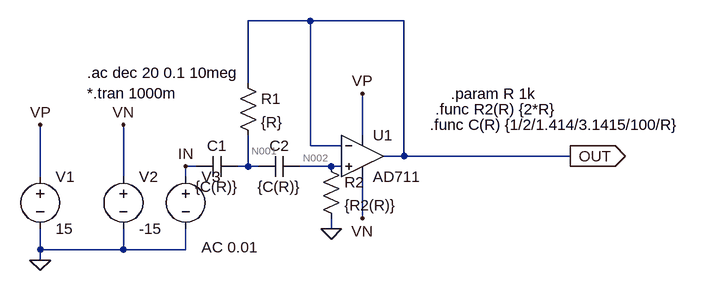
[diagram p0: schematic A2 32.asc]
A2 32.asc, the LTspice schematic file:
Version 4
SHEET 1 880 680
WIRE 80 -32 -16 -32
WIRE 224 -32 80 -32
WIRE -16 64 -16 -32
WIRE 160 144 160 80
WIRE 80 160 80 -32
WIRE 128 160 80 160
WIRE 224 176 224 -32
WIRE 224 176 192 176
WIRE 480 176 224 176
WIRE -96 192 -112 192
WIRE -16 192 -16 144
WIRE -16 192 -32 192
WIRE 0 192 -16 192
WIRE 112 192 64 192
WIRE 128 192 112 192
WIRE -336 208 -336 128
WIRE -208 208 -208 128
WIRE -112 208 -112 192
WIRE 160 272 160 208
WIRE 112 288 112 272
WIRE -336 320 -336 288
WIRE -208 320 -208 288
WIRE -208 320 -336 320
WIRE -112 320 -112 288
WIRE -112 320 -208 320
WIRE -336 336 -336 320
FLAG 160 80 VP
FLAG 160 272 VN
FLAG -336 336 0
FLAG -336 128 VP
FLAG -208 128 VN
FLAG 480 176 OUT
IOPIN 480 176 Out
FLAG 112 288 0
FLAG -112 192 IN
SYMBOL OpAmps\\AD711 160 112 R0
SYMATTR InstName U1
SYMBOL voltage -336 192 R0
SYMATTR InstName V1
SYMATTR Value 15
SYMBOL voltage -208 192 R0
SYMATTR InstName V2
SYMATTR Value -15
SYMBOL voltage -112 192 R0
WINDOW 123 24 124 Left 2
WINDOW 39 0 0 Left 0
SYMATTR Value2 AC 0.01
SYMATTR InstName V3
SYMATTR Value ""
SYMBOL cap -32 176 R90
WINDOW 0 0 32 VBottom 2
WINDOW 3 32 32 VTop 2
SYMATTR InstName C1
SYMATTR Value {C(R)}
SYMBOL cap 64 176 R90
WINDOW 0 0 32 VBottom 2
WINDOW 3 32 32 VTop 2
SYMATTR InstName C2
SYMATTR Value {C(R)}
SYMBOL res -32 48 R0
SYMATTR InstName R1
SYMATTR Value {R}
SYMBOL res 96 176 R0
SYMATTR InstName R2
SYMATTR Value {R2(R)}
TEXT -264 48 Left 2 !.ac dec 20 0.1 10meg\n*.tran 1000m
TEXT 296 80 Left 2 !.param R 1k
TEXT 264 128 Left 2 !.func C(R) {1/2/1.414/3.1415/100/R}
TEXT 272 104 Left 2 !.func R2(R) {2*R}

The netlist it stands for:
* A2 32.asc
XU1 N002 OUT VP VN OUT AD712  ; AD711, pins In+ In- V+ V- OUT
V1 VP 0 15
V2 VN 0 -15
V3 IN 0 AC 0.01
C1 N001 IN {C(R)}
C2 N002 N001 {C(R)}
R1 OUT N001 {R}
R2 N002 0 {R2(R)}
.ac dec 20 0.1 10meg
*.tran 1000m
.param R 1k
.func C(R) {1/2/1.414/3.1415/100/R}
.func R2(R) {2*R}
.lib ADI1.lib
.backanno
.end

* Results of the author's LTspice run, read from the files saved beside the schematic
* Operating Point, zero values left out:
*   V(out) = -50 nV
*   V(n002) = -50 nV
*   V(vp) = 15 V
*   V(vn) = -15 V
*   V(n001) = -50 nV
*   I(R2) = -25 pA
*   I(V2) = 4.899 mA
*   I(V1) = -4.899 mA
*   Ix(u1:1) = 25 pA
*   Ix(u1:2) = 25 pA
*   Ix(u1:3) = 4.899 mA
*   Ix(u1:4) = -4.899 mA
*   Ix(u1:5) = -25 pA
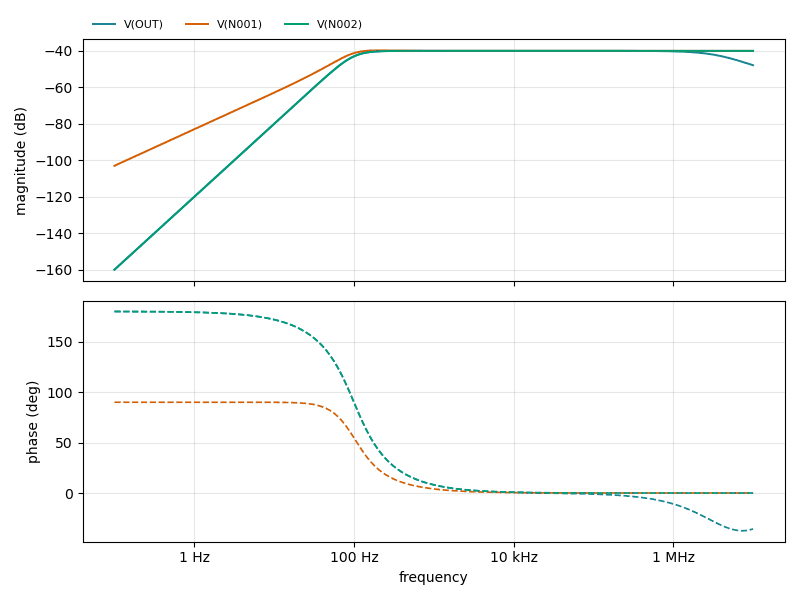
[diagram p1: AC Analysis of A2 32.asc, plotted from the saved traces]
* AC Analysis, 1 run:
*   V(OUT): -160.00 dB at 100 mHz, -47.86 dB at 10 MHz, peak -40.00 dB at 3.981 kHz, 3 dB below the peak at 99.98 Hz and 4.095 MHz
*   V(N001): -103.01 dB at 100 mHz, -40.00 dB at 10 MHz, peak -39.75 dB at 199.5 Hz, 3 dB below the peak at 81.01 Hz
*   V(N002): -160.00 dB at 100 mHz, -40.00 dB at 10 MHz, peak -40.00 dB at 10 MHz, 3 dB below the peak at 99.98 Hz